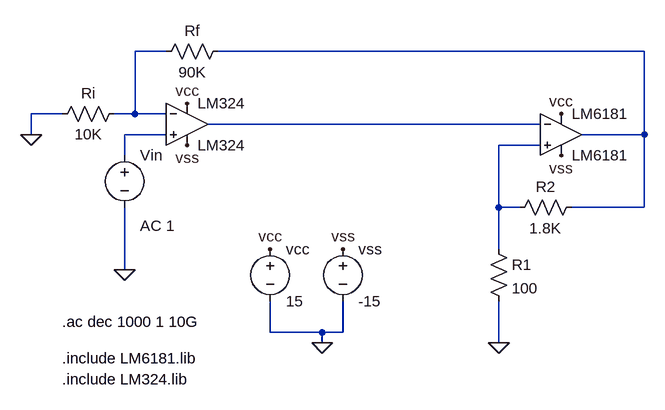
[diagram p0: schematic simulacion.asc]
simulacion.asc, the LTspice schematic file:
Version 4.1
SHEET 1 1056 680
WIRE -336 48 -384 48
WIRE 400 48 -256 48
WIRE -496 144 -544 144
WIRE -384 144 -384 48
WIRE -384 144 -416 144
WIRE -336 144 -384 144
WIRE 240 160 -272 160
WIRE -544 176 -544 144
WIRE -336 176 -400 176
WIRE 400 176 400 48
WIRE 400 176 304 176
WIRE 240 192 176 192
WIRE -400 208 -400 176
WIRE 176 288 176 192
WIRE 208 288 176 288
WIRE 400 288 400 176
WIRE 400 288 288 288
WIRE 176 352 176 288
WIRE -400 384 -400 288
WIRE -176 480 -176 432
WIRE -96 480 -176 480
WIRE -64 480 -64 432
WIRE -64 480 -96 480
WIRE -96 496 -96 480
WIRE 176 496 176 432
FLAG 176 496 0
FLAG -544 176 0
FLAG -176 352 vcc
FLAG -304 128 vcc
FLAG 272 144 vcc
FLAG -64 352 vss
FLAG 272 208 vss
FLAG -304 192 vss
FLAG -96 496 0
FLAG -400 384 0
SYMBOL OpAmps\\opamp2 272 112 R0
SYMATTR InstName LM6181
SYMATTR Value LM6181
SYMBOL voltage -176 336 R0
SYMATTR InstName vcc
SYMATTR Value 15
SYMBOL voltage -64 336 R0
SYMATTR InstName vss
SYMATTR Value -15
SYMBOL OpAmps\\opamp2 -304 96 R0
SYMATTR InstName LM324
SYMATTR Value LM324
SYMBOL res -400 128 R90
WINDOW 0 0 56 VBottom 2
WINDOW 3 32 56 VTop 2
SYMATTR InstName Ri
SYMATTR Value 10K
SYMBOL res -240 32 R90
WINDOW 0 0 56 VBottom 2
WINDOW 3 32 56 VTop 2
SYMATTR InstName Rf
SYMATTR Value 90K
SYMBOL res 304 272 R90
WINDOW 0 0 56 VBottom 2
WINDOW 3 32 56 VTop 2
SYMATTR InstName R2
SYMATTR Value 1.8K
SYMBOL res 160 336 R0
SYMATTR InstName R1
SYMATTR Value 100
SYMBOL voltage -400 192 R0
WINDOW 123 24 124 Left 2
WINDOW 39 0 0 Left 0
SYMATTR InstName Vin
SYMATTR Value ""
SYMATTR Value2 AC 1
TEXT -496 520 Left 2 !.include LM6181.lib
TEXT -496 552 Left 2 !.include LM324.lib
TEXT -496 464 Left 2 !.ac dec 1000 1 10G

The netlist it stands for:
* simulacion.asc
X§LM6181 N005 N003 vcc vss N002 LM6181  ; pins In+ In- V+ V- OUT
vcc vcc 0 15
vss vss 0 -15
X§LM324 N004 N001 vcc vss N003 LM324  ; pins In+ In- V+ V- OUT
Ri N001 0 10K
Rf N002 N001 90K
R2 N002 N005 1.8K
R1 N005 0 100
Vin N004 0 AC 1
.include LM6181.lib
.include LM324.lib
.ac dec 1000 1 10G
.backanno
.end